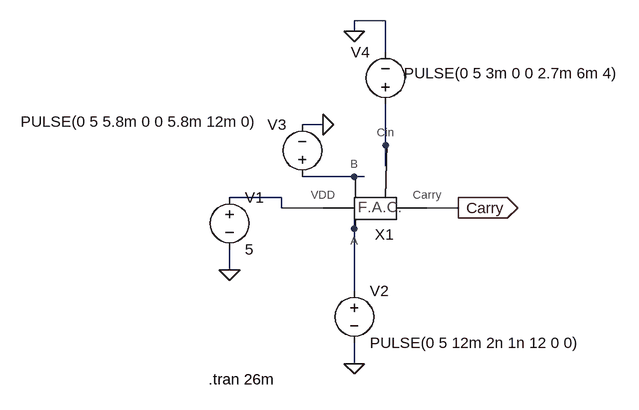
[diagram p0: schematic Simulating_Full_Adder_Carry.asc]
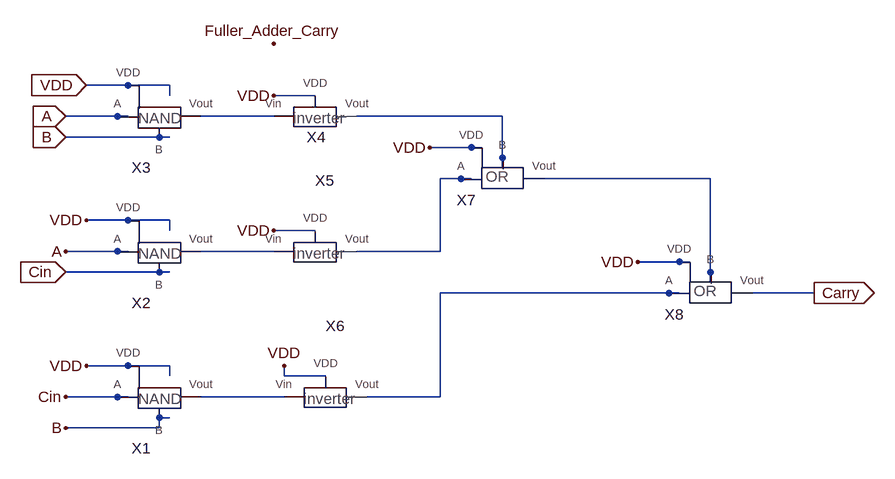
[diagram p1: sub-circuit fuller_adder_carry.asc]
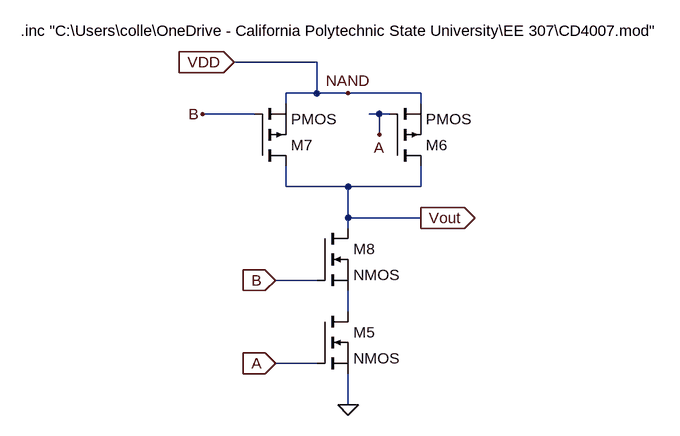
[diagram p2: sub-circuit nand_gate.asc]
Simulating_Full_Adder_Carry.asc, the LTspice schematic file:
Version 4
SHEET 1 880 680
WIRE 96 -128 48 -128
WIRE 48 -112 48 -128
WIRE 96 -80 96 -128
WIRE 0 32 -32 32
WIRE 96 64 96 0
WIRE 96 96 96 64
WIRE 48 112 -32 112
WIRE 64 112 48 112
WIRE -64 144 -144 144
WIRE -64 160 -64 144
WIRE 0 160 -64 160
WIRE 208 160 160 160
WIRE 48 192 48 176
WIRE -144 256 -144 224
WIRE 48 288 48 192
WIRE 48 400 48 368
FLAG 48 400 0
FLAG -144 256 0
FLAG 48 -112 0
FLAG 0 32 0
FLAG 208 160 Carry
IOPIN 208 160 Out
SYMBOL Fuller_Adder_Carry 112 176 R0
SYMATTR InstName X1
SYMBOL voltage -144 128 R0
WINDOW 123 0 0 Left 2
WINDOW 39 0 0 Left 2
SYMATTR InstName V1
SYMATTR Value 5
SYMBOL voltage 48 272 R0
WINDOW 123 0 0 Left 2
WINDOW 39 0 0 Left 2
SYMATTR InstName V2
SYMATTR Value PULSE(0 5 12m 2n 1n 12 0 0)
SYMBOL voltage -32 128 R180
WINDOW 0 24 96 Left 2
WINDOW 3 69 101 Left 2
WINDOW 123 0 0 Left 2
WINDOW 39 0 0 Left 2
SYMATTR InstName V3
SYMATTR Value PULSE(0 5 5.8m 0 0 5.8m 12m 0)
SYMBOL voltage 96 16 R180
WINDOW 0 24 96 Left 2
WINDOW 3 -359 63 Left 2
WINDOW 123 0 0 Left 2
WINDOW 39 0 0 Left 2
SYMATTR InstName V4
SYMATTR Value PULSE(0 5 3m 0 0 2.7m 6m 4)
TEXT -176 424 Left 2 !.tran 26m

fuller_adder_carry.asc, the sub-circuit schematic file:
Version 4
SHEET 1 1208 680
WIRE 96 -192 -32 -192
WIRE 96 -176 96 -192
WIRE 320 -176 256 -176
WIRE 32 -144 -64 -144
WIRE 160 -144 144 -144
WIRE 256 -144 160 -144
WIRE 608 -144 384 -144
WIRE 96 -112 -64 -112
WIRE 560 -96 496 -96
WIRE 576 -96 560 -96
WIRE 608 -80 608 -144
WIRE 608 -64 608 -80
WIRE 544 -48 512 -48
WIRE 560 -48 544 -48
WIRE 928 -48 672 -48
WIRE 96 16 -32 16
WIRE 96 32 96 16
WIRE 320 32 256 32
WIRE 32 64 -64 64
WIRE 160 64 144 64
WIRE 256 64 160 64
WIRE 512 64 512 -48
WIRE 512 64 384 64
WIRE 880 80 816 80
WIRE 896 80 880 80
WIRE 96 96 -64 96
WIRE 928 96 928 -48
WIRE 928 112 928 96
WIRE 864 128 512 128
WIRE 880 128 864 128
WIRE 1088 128 992 128
WIRE 96 240 -32 240
WIRE 96 256 96 240
WIRE 272 256 272 240
WIRE 336 256 272 256
WIRE 32 288 -64 288
WIRE 160 288 144 288
WIRE 272 288 160 288
WIRE 512 288 512 128
WIRE 512 288 400 288
WIRE 96 320 80 320
WIRE 80 336 80 320
WIRE 80 336 -64 336
FLAG 1088 128 Carry
IOPIN 1088 128 Out
FLAG -64 -144 A
IOPIN -64 -144 In
FLAG -64 64 A
FLAG -64 -112 B
IOPIN -64 -112 In
FLAG -64 336 B
FLAG -64 288 Cin
FLAG -64 96 Cin
IOPIN -64 96 In
FLAG -32 240 VDD
FLAG 272 240 VDD
FLAG 256 32 VDD
FLAG 256 -176 VDD
FLAG -32 16 VDD
FLAG 496 -96 VDD
FLAG 816 80 VDD
FLAG -32 -192 VDD
IOPIN -32 -192 In
FLAG 256 -256 Fuller_Adder_Carry
SYMBOL Nand_gate 128 304 R0
SYMATTR InstName X1
SYMBOL Nand_gate 128 80 R0
SYMATTR InstName X2
SYMBOL Nand_gate 128 -128 R0
SYMATTR InstName X3
SYMBOL Inverter 352 -128 R0
WINDOW 0 -45 16 Left 2
SYMATTR InstName X4
SYMBOL Inverter 352 80 R0
SYMATTR InstName X5
SYMBOL Inverter 368 304 R0
SYMATTR InstName X6
SYMBOL OR_gate 640 -48 R0
SYMATTR InstName X7
SYMBOL OR_gate 960 128 R0
SYMATTR InstName X8

nand_gate.asc, the sub-circuit schematic file:
Version 4
SHEET 1 880 680
WIRE -224 -192 -352 -192
WIRE -224 -144 -224 -192
WIRE -224 -144 -272 -144
WIRE -176 -144 -224 -144
WIRE -64 -144 -176 -144
WIRE -272 -128 -272 -144
WIRE -64 -128 -64 -144
WIRE -320 -112 -400 -112
WIRE -128 -112 -144 -112
WIRE -112 -112 -128 -112
WIRE -128 -80 -128 -112
WIRE -272 0 -272 -32
WIRE -176 0 -272 0
WIRE -64 0 -64 -32
WIRE -64 0 -176 0
WIRE -176 48 -176 0
WIRE -64 48 -176 48
WIRE -176 64 -176 48
WIRE -224 144 -288 144
WIRE -176 192 -176 160
WIRE -224 272 -288 272
WIRE -176 336 -176 288
FLAG -176 -144 NAND
FLAG -176 336 0
FLAG -288 272 A
IOPIN -288 272 In
FLAG -128 -80 A
FLAG -400 -112 B
FLAG -288 144 B
IOPIN -288 144 In
FLAG -64 48 Vout
IOPIN -64 48 Out
FLAG -352 -192 VDD
IOPIN -352 -192 In
SYMBOL nmos -224 192 R0
SYMATTR InstName M5
SYMBOL pmos -112 -32 M180
SYMATTR InstName M6
SYMBOL pmos -320 -32 M180
SYMATTR InstName M7
SYMBOL nmos -224 64 R0
SYMATTR InstName M8
TEXT -680 -240 Left 2 !.inc "C:\\Users\\colle\\OneDrive - California Polytechnic State University\\EE 307\\CD4007.mod"

The netlist it stands for:
* Simulating_Full_Adder_Carry.asc
XX1 Carry N003 N002 N004 N001 fuller_adder_carry
V1 N003 0 5
V2 N004 0 PULSE(0 5 12m 2n 1n 12 0 0)
V3 N002 0 PULSE(0 5 5.8m 0 0 5.8m 12m 0)
V4 N001 0 PULSE(0 5 3m 0 0 2.7m 6m 4)

* block symbol definitions
.subckt fuller_adder_carry Carry VDD B A Cin
XX1 Cin B N007 VDD nand_gate
XX2 A Cin N005 VDD nand_gate
XX3 A B N001 VDD nand_gate
XX4 N001 VDD N002 Inverter  ; pins Vin VDD Vout
XX5 N005 VDD N003 Inverter  ; pins Vin VDD Vout
XX6 N007 VDD N006 Inverter  ; pins Vin VDD Vout
XX7 N003 N002 N004 VDD OR_gate  ; pins A B Vout VDD
XX8 N006 N004 Carry VDD OR_gate  ; pins A B Vout VDD
.ends fuller_adder_carry

.subckt nand_gate A B Vout VDD
M5 N001 A 0 0 NMOS
M6 Vout A VDD VDD PMOS
M7 Vout B VDD VDD PMOS
M8 Vout B N001 N001 NMOS
.inc "C:\Users\colle\OneDrive - California Polytechnic State University\EE 307\CD4007.mod"
.ends nand_gate

.model NMOS NMOS
.model PMOS PMOS
.lib standard.mos
.tran 26m
.backanno
.end